# Altium project breakout_32QFN-32TQFP.PrjPcb
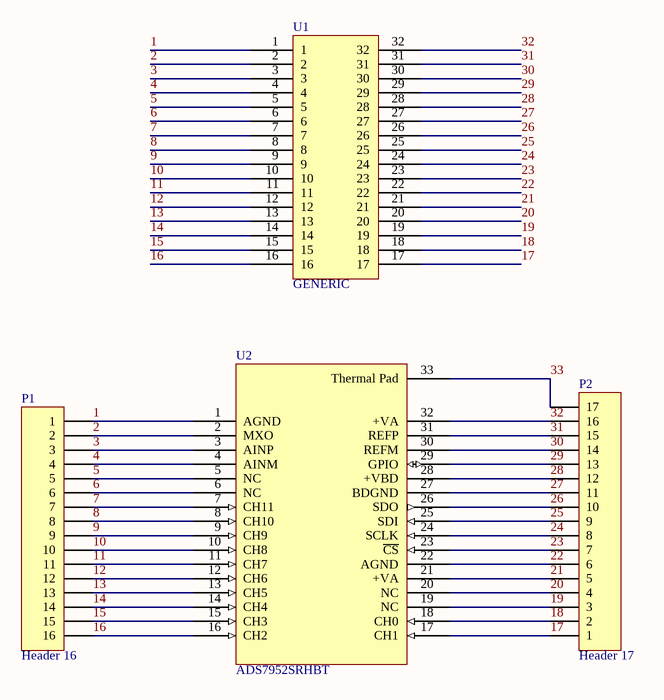
[diagram p0: breakout_32QFN-32TQFP.SchDoc]
1 sheet, 4 parts. Net scope: global (net labels, ports and power ports of the same name join across sheets).
Board files: breakout_32QFN-32TQFP.PcbDoc, panel.PcbDoc

## Sheet breakout_32QFN-32TQFP.SchDoc
size A

### Parts
P1  Header 16  [HDR1X16]
P2  Header 17  [HDR1X17]
U1  GENERIC  [TQFP80P900X900X120-32N-GENERIC]
U2  ADS7952SRHBT  [ADS7952SRHBT]

### Nets
1: P1.1 U1.1 U2.1(AGND)
2: P1.2 U1.2 U2.2(MXO)
3: P1.3 U1.3 U2.3(AINP)
4: P1.4 U1.4 U2.4(AINM)
5: P1.5 U1.5 U2.5(NC)
6: P1.6 U1.6 U2.6(NC)
7: P1.7 U1.7 U2.7(CH11)
8: P1.8 U1.8 U2.8(CH10)
9: P1.9 U1.9 U2.9(CH9)
10: P1.10 U1.10 U2.10(CH8)
11: P1.11 U1.11 U2.11(CH7)
12: P1.12 U1.12 U2.12(CH6)
13: P1.13 U1.13 U2.13(CH5)
14: P1.14 U1.14 U2.14(CH4)
15: P1.15 U1.15 U2.15(CH3)
16: P1.16 U1.16 U2.16(CH2)
17: P2.1 U1.17 U2.17(CH1)
18: P2.2 U1.18 U2.18(CH0)
19: P2.3 U1.19 U2.19(NC)
20: P2.4 U1.20 U2.20(NC)
21: P2.5 U1.21 U2.21(+VA)
22: P2.6 U1.22 U2.22(AGND)
23: P2.7 U1.23 U2.23(~{CS})
24: P2.8 U1.24 U2.24(SCLK)
25: P2.9 U1.25 U2.25(SDI)
26: P2.10 U1.26 U2.26(SDO)
27: P2.11 U1.27 U2.27(BDGND)
28: P2.12 U1.28 U2.28(+VBD)
29: P2.13 U1.29 U2.29(GPIO)
30: P2.14 U1.30 U2.30(REFM)
31: P2.15 U1.31 U2.31(REFP)
32: P2.16 U1.32 U2.32(+VA)
33: P2.17 U2.33(Thermal_Pad)

### Library data of the parts
P1 = Header 16: Header, 16-Pin; LatestRevisionDate: 17-Jul-2002; LatestRevisionNote: Re-released for DXP Platform.; Publisher: Altium Limited
P2 = Header 17: Header, 17-Pin; LatestRevisionDate: 17-Jul-2002; LatestRevisionNote: Re-released for DXP Platform.; Publisher: Altium Limited
U1 = TQFP80P900X900X120-32N-GENERIC
U2 = ADS7952SRHBT: Digikey: 296-25843-1-ND -- 12 Bit Analog to Digital Converter 12 Input 1 SAR 32-VQFN (5x5)